# Altium schematic sheet СФ МЭИ ЛБ ПЭ2-18 11.03.04 03 Э3.SchDoc
size 420 x 297 mm; Scale: 1:1; Разраб.: Гончаренко В.Ю.; Пров.: Смолин В.А.; Номер листа: 1; Общее количество листов: 1; Наименование изделия 1: Стабилизатор напряжения; Наименование изделия 2: Схема электрическая; Наименование изделия 3: принципиальная; Нач. отд.: Нач. отд.; Децимальный номер: СФ МЭИ ЛБ ПЭ2-18 11.03.04 03 Э3; Наименование. Строка 2: напряжения; Наименование. Строка 3: Схема электирическая принципиальная; Наименование. Строка 1: Стабилизатор; Разработал: Гончаренко В.Ю.; Проверил: Смолин В.А.; Утвердил: Рассказа Д.С.; Литера: У; Масштаб: 1:1; Лист. Номер: 1; Лист. Всего: 1
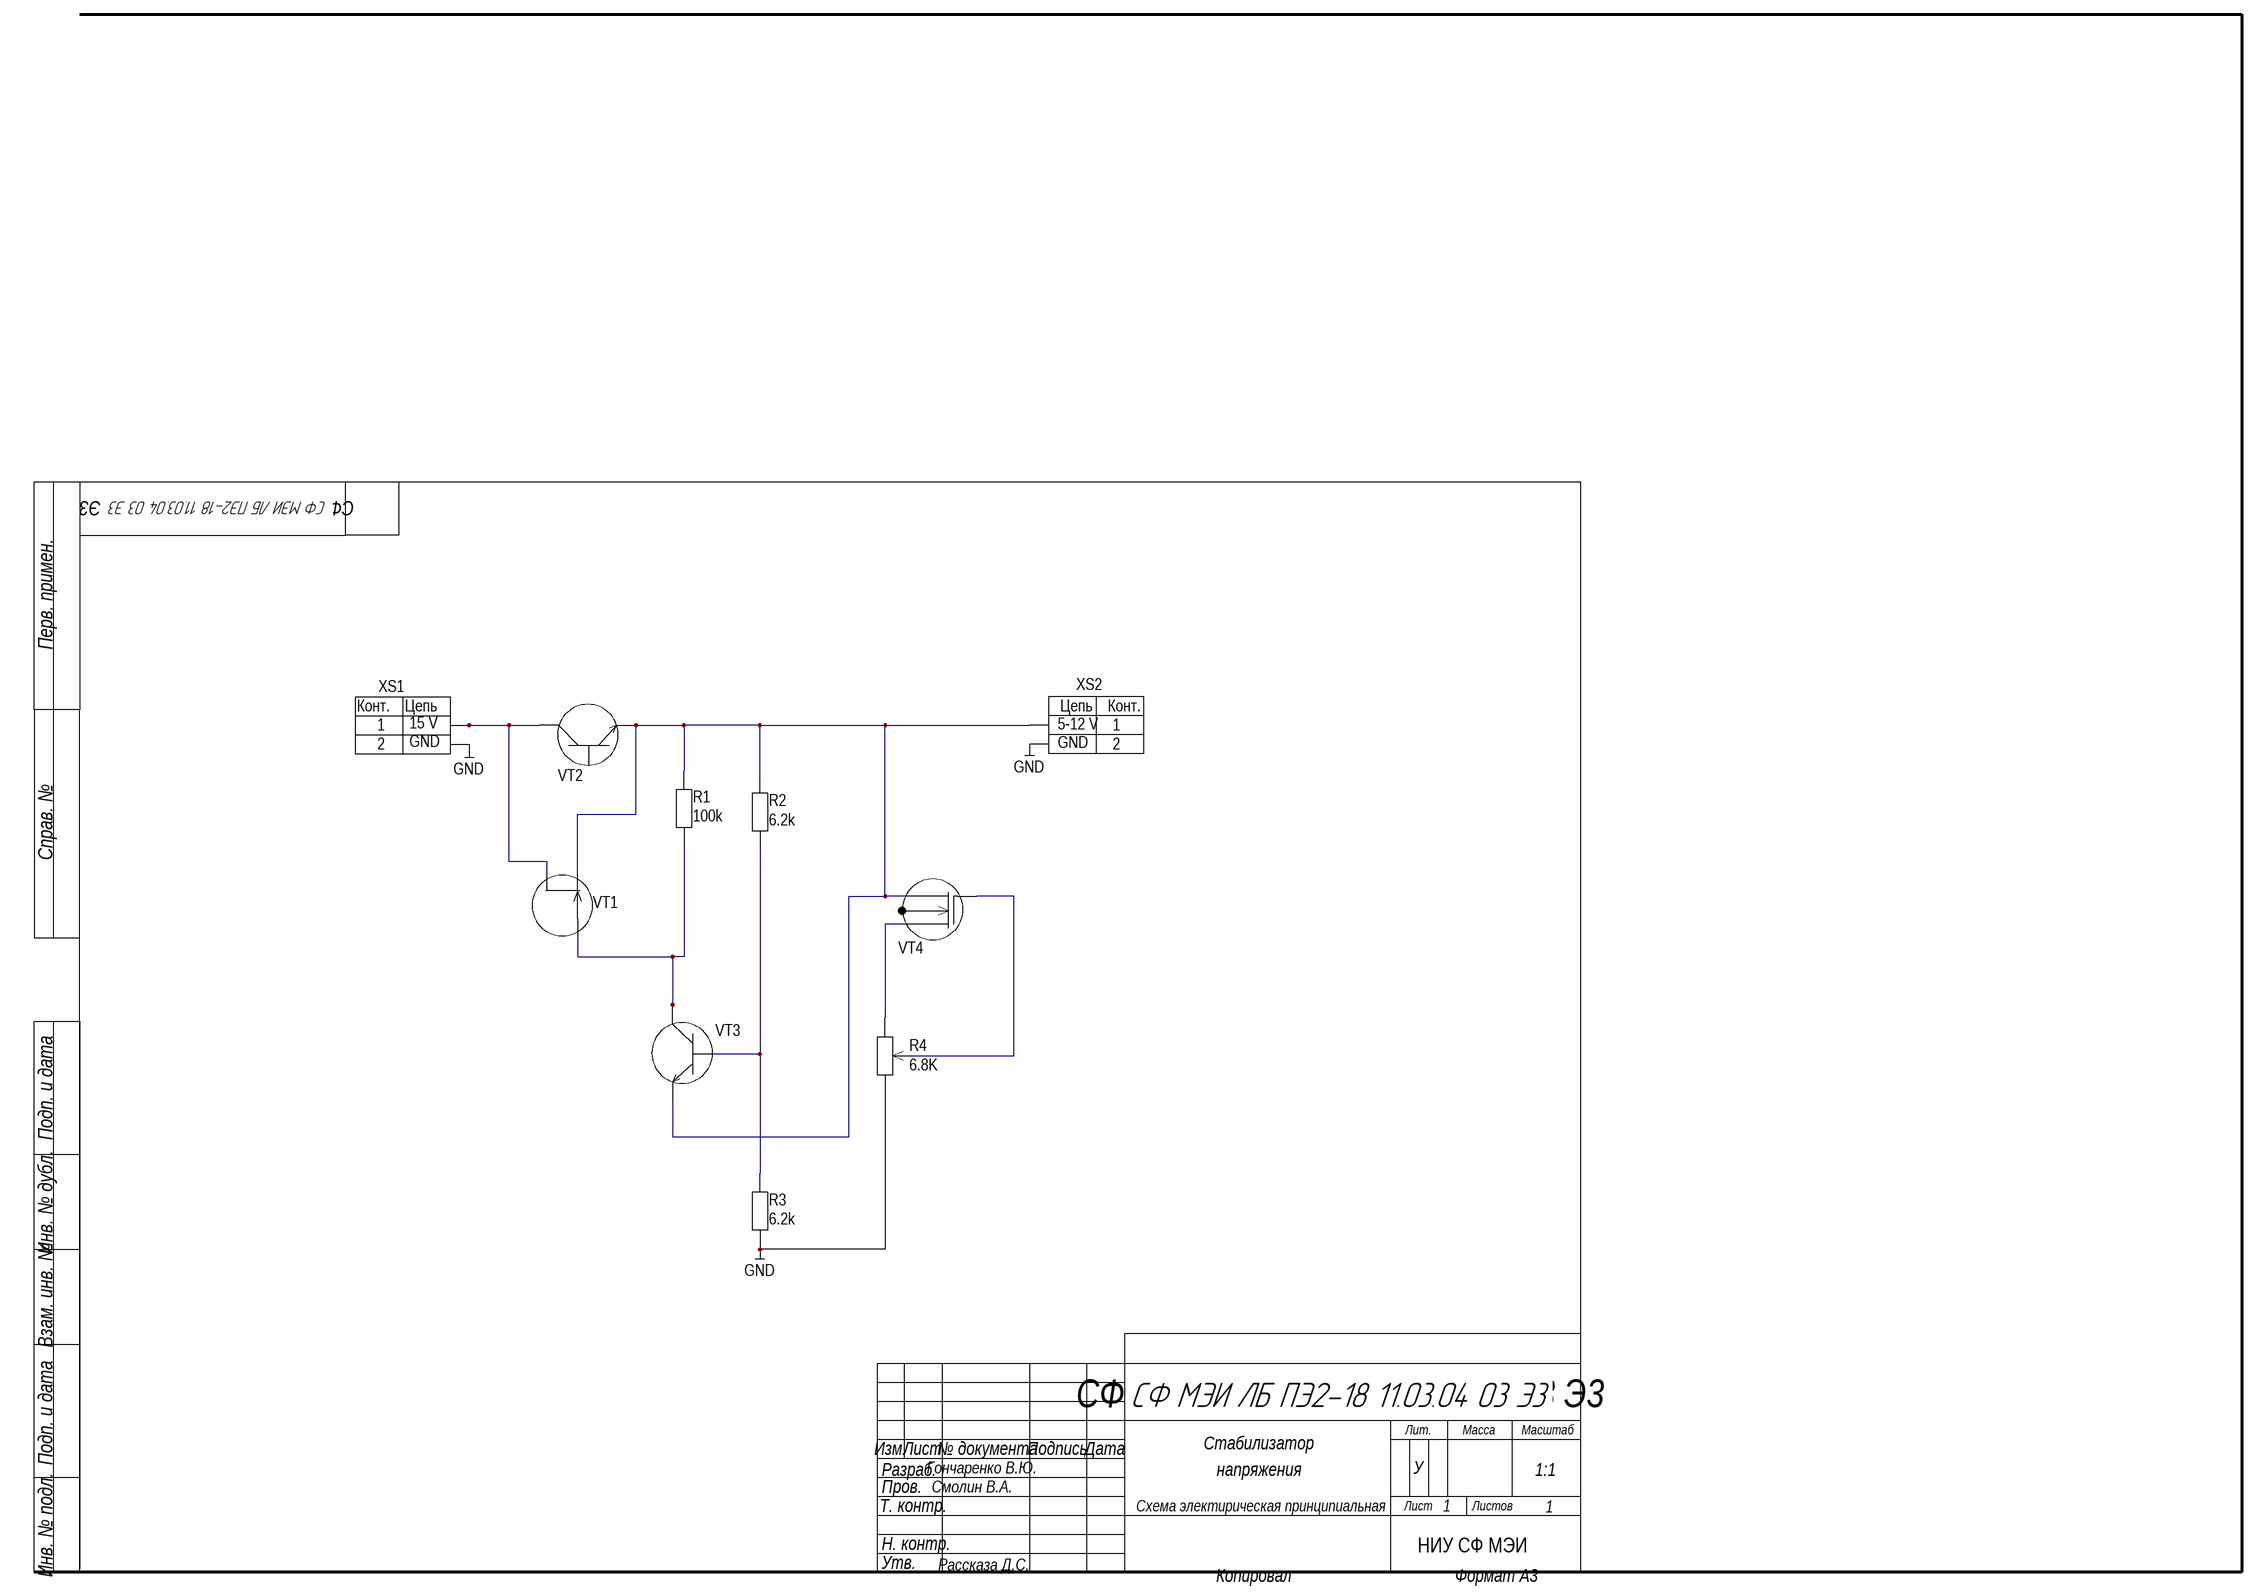
[diagram p0: СФ МЭИ ЛБ ПЭ2-18 11.03.04 03 Э3.SchDoc]

## Parts
R1  100k  [0805]
R2  6.2k  [0805]
R3  6.2k  [0805]
R4  6.8K  [ST32]
VT1  Полевойтранзистор с изолированым затвором  [SOT23]  (value not drawn)
VT2  Биполярный транзистор n-p-n  [SOT23]  (value not drawn)
VT3  Биполярный транзистор n-p-n  [SOT23]  (value not drawn)
VT4  Полевой транзистор с изолированым затвором n-типа  [SOT23]  (value not drawn)
XS1  SM02B  [CI1102M1H  (F)]  (value not drawn)
XS2  SM02B  [CI1102M1H  (F)]  (value not drawn)

## Nets
GND: R3.1 R4.2 XS1.2(Pin2) XS2.2(Pin2)
NetR1_1: R1.1 VT1.3(G) VT3.2(E)
NetR1_2: R1.2 R2.2 VT1.1(S) VT2.3(K) VT3.3(K) VT4.2(S) XS2.1(Pin1)
NetR2_1: R2.1 R3.2 VT3.1(B)
NetR4_1: R4.1 VT4.3(D)
NetR4_3: R4.3 VT4.1(G)
NetVT1_2: VT1.2(D) VT2.2(E) XS1.1(Pin1)

Not connected (* = marked no-connect by the designer): VT2 1(B)

## Notes on the sheet
- (near XS1) 15 V
- (near XS2) 5-12 V
- (near XS1) GND
- (near XS2) GND
- НИУ СФ МЭИ ПЭ2-18
- Перв. примен.
- Справ. №
- Подп. и дата
- Инв. № дубл.
- Взам. инв. №
- Разраб.
- Изм.
- Лист
- № документа
- Подпись
- Дата
- Лит.
- Масса
- Масштаб
- Т. контр.
- Пров.
- Листов
- Инв. № подл.
- Н. контр.
- Утв.
- Копировал
- Формат A3
- (in symbol SM02B) Цепь; Конт.

## Library data of the parts
R1 = 0.125Вт 0805 100 кОм, 5%, Чип резистор (SMD): 0805-0.125 Вт -100 кОм±5%
R2 R3 = 0.125Вт 0805 6.2 кОм, 5%, Чип резистор (SMD): 0805-0.125 Вт -6.2 кОм±5%
R4 = 0.125Вт 0805 6.8 кОм, 5%, подстроечный чип резистор (SMD): 0805-0.125 Вт -6.8 кОм±5%
VT1 = IRFML8244TRPBF: 303Г
VT2 = BFR540: КТ608Б
VT3 = BFR540_1: КТ312В
VT4 = BSS83P H6327XTSA1: КП305Г